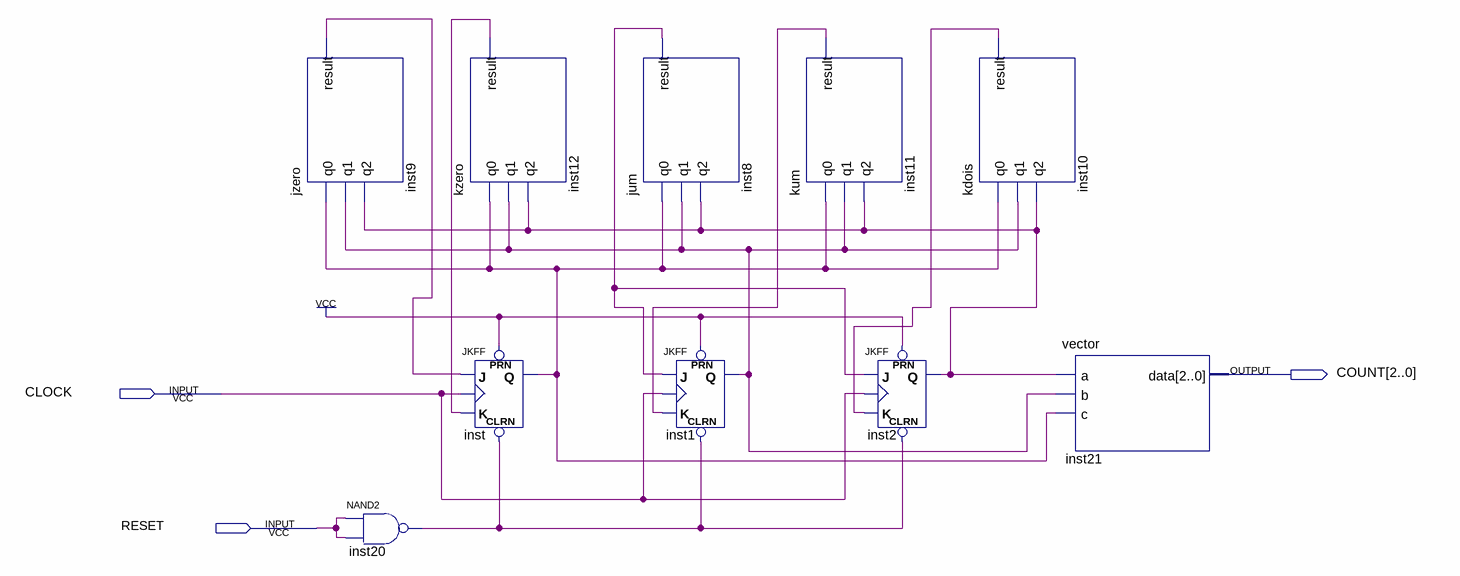
[diagram p0: schematic sheet]
// Quartus schematic exp8.bdf as structural Verilog: 10 symbols, 3 pins
module exp8 (
  input  CLOCK,
  input  RESET,
  output [2:0] COUNT
);

  wire inst1_q, inst2_q, inst8_result, inst9_result, inst10_result, inst11_result, inst12_result, inst20_out,
       inst_q;

  jzero inst9 (.q0(inst_q), .q1(inst1_q), .q2(inst2_q), .result(inst9_result));
  nand inst20 (inst20_out, RESET, RESET);
  kzero inst12 (.q0(inst_q), .q1(inst1_q), .q2(inst2_q), .result(inst12_result));
  JKFF inst (.PRN(1'b1), .CLRN(inst20_out), .K(inst12_result), .J(inst9_result), .CLK(CLOCK), .Q(inst_q));
  jum inst8 (.q0(inst_q), .q1(inst1_q), .q2(inst2_q), .result(inst8_result));
  JKFF inst1 (.PRN(1'b1), .CLRN(inst20_out), .K(inst11_result), .J(inst8_result), .CLK(CLOCK), .Q(inst1_q));
  kum inst11 (.q0(inst_q), .q1(inst1_q), .q2(inst2_q), .result(inst11_result));
  JKFF inst2 (.PRN(1'b1), .CLRN(inst20_out), .K(inst10_result), .J(inst8_result), .CLK(CLOCK), .Q(inst2_q));
  kdois inst10 (.q0(inst_q), .q1(inst1_q), .q2(inst2_q), .result(inst10_result));
  vector inst21 (.a(inst2_q), .b(inst1_q), .c(inst_q), .data(COUNT));
endmodule
